# EAGLE design rfm98pw-wing (EAGLE 9.4.2)
PROJECT_AUTHOR: Tinkerman <xose.perez@gmail.com>; PROJECT_LICENSE: CC-BY-SA 4.0 Intl.; PROJECT_NAME: RFM98PW Feather Wing; PROJECT_VERSION: 0.1.20190707
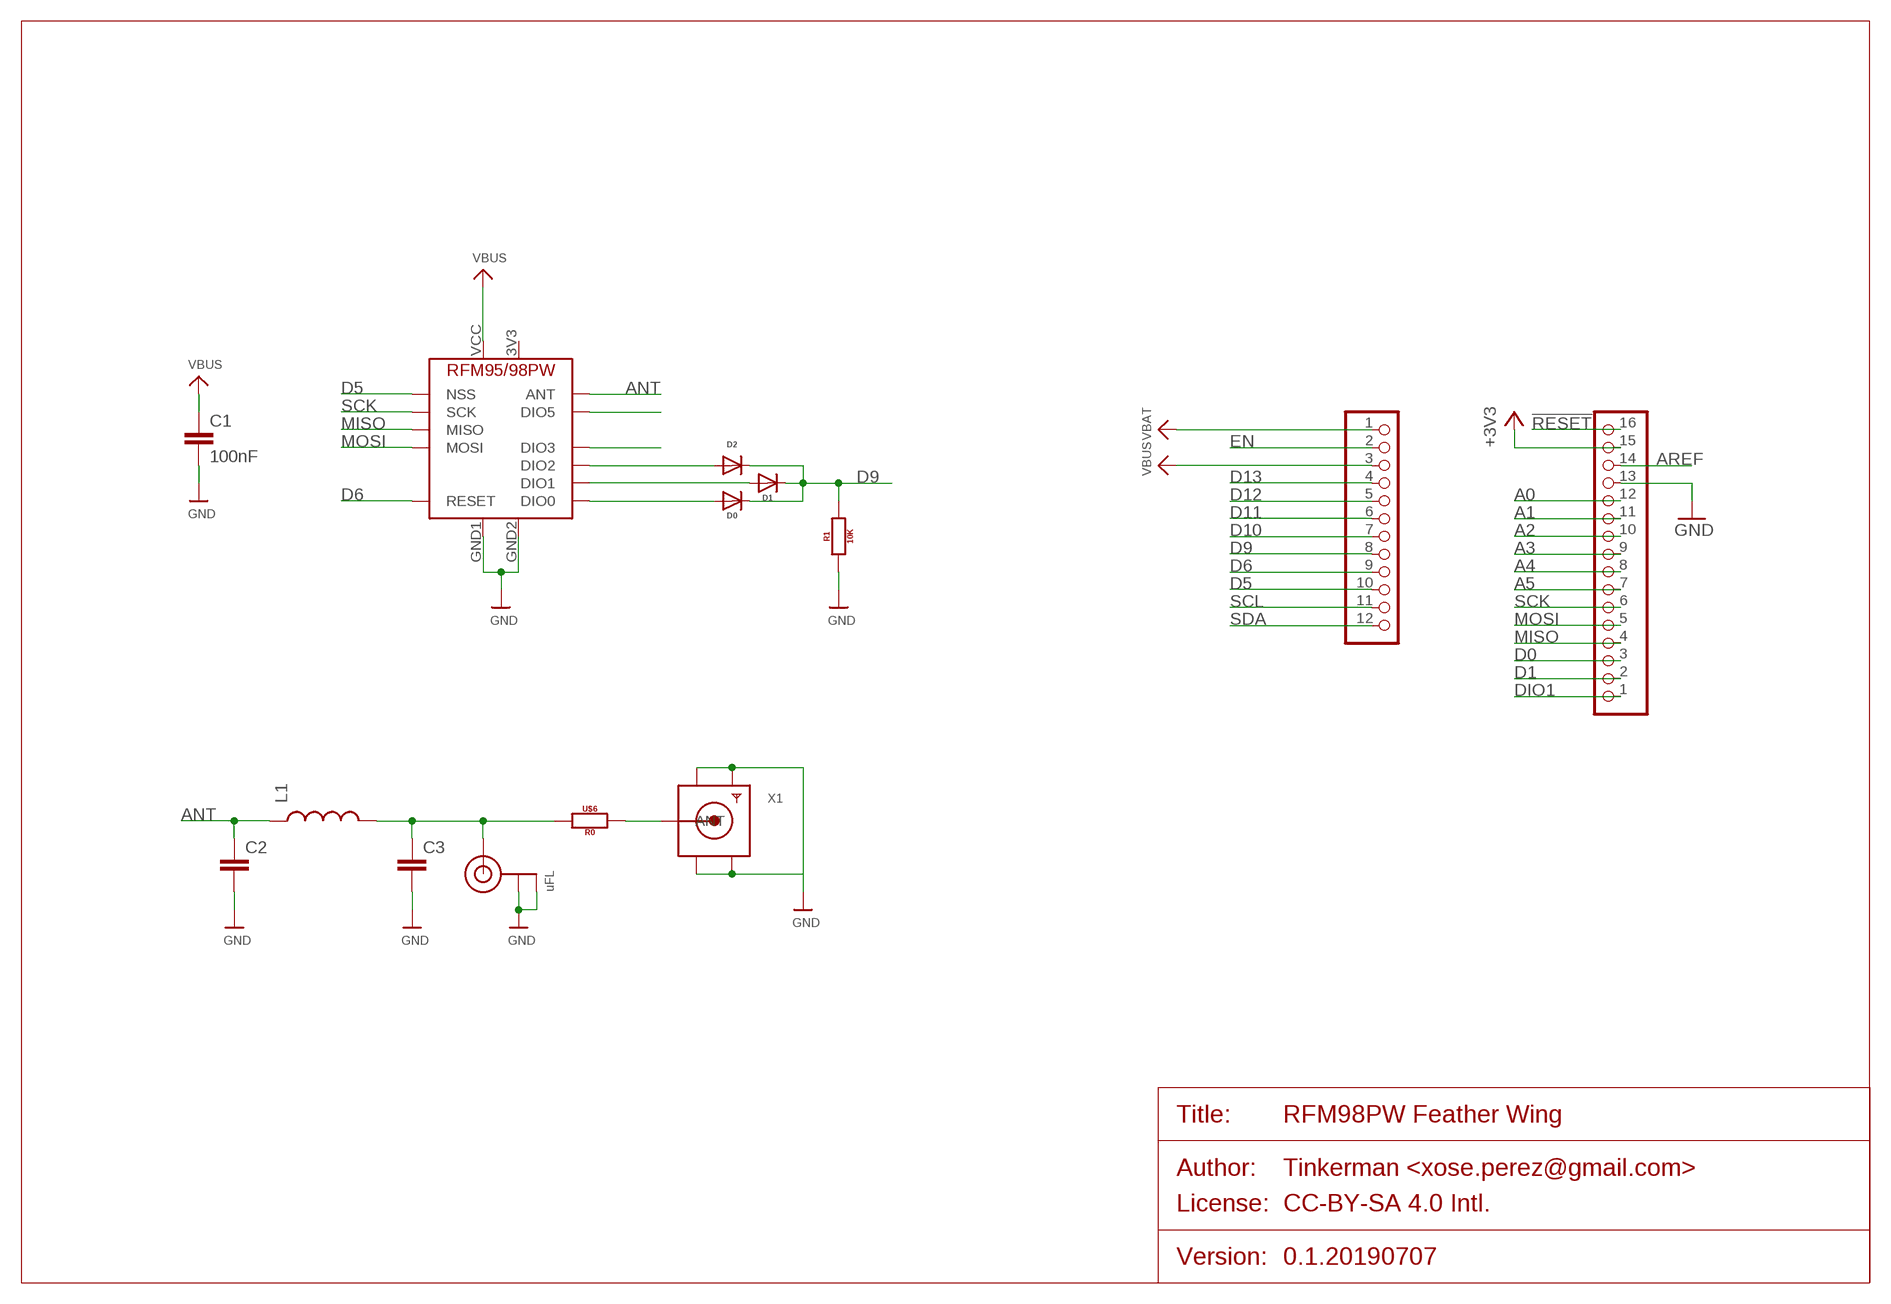
[diagram p0: schematic, sheet 1]

## Parts
C1  100nF  C-EUC0805K  [C0805K]
C2  C-EUC0805K  [C0805K]
C3  C-EUC0805K  [C0805K]
D0  DIODE-SMD  [0805_DIODE]
D1  DIODE-SMD  [0805_DIODE]
D2  DIODE-SMD  [0805_DIODE]
JP1  HEADER-1X16ROUND  [1X16_ROUND]
JP3  HEADER-1X12  [1X12_ROUND]
L1  INDUCTOR-SPARKFUN0805  [0805]
R1  10K  RESISTOR0805  [0805]
U$6  R0  RESISTOR0805  [0805]
U$24  RFM95PW-RFM98PW  [RFM95PW-RFM98PW]
X1  SMACONNECTOR_EDGE  [SMA_EDGELAUNCH]
X4  uFL  ANTENNA_U.FL  [U.FL]

## Nets
!RESET: JP1.16
+3V3: JP1.15
A0: JP1.12
A1: JP1.11
A2: JP1.10
A3: JP1.9
A4: JP1.8
A5: JP1.7
ANT: C2.1 L1.1 U$24.ANT
ANT1: U$6.2 X1.P(ANT)
AREF: JP1.14
D0: JP1.3
D1: JP1.2
D5: JP3.10 U$24.NSS
D6: JP3.9 U$24.RESET
D9: D0.C D1.C D2.C JP3.8 R1.2
D10: JP3.7
D11: JP3.6
D12: JP3.5
D13: JP3.4
DIO1: JP1.1
EN: JP3.2
GND: C1.2 C2.2 C3.2 JP1.13 R1.1 U$24.GND1 U$24.GND2 X1.GND@1(GND4) X1.GND@2(GND3) X1.GND@3(GND2) X1.GND@4(GND1) X4.1(GND) X4.2(GND)
MISO: JP1.4 U$24.MISO
MOSI: JP1.5 U$24.MOSI
N$3: D0.A U$24.DIO0
N$4: D1.A U$24.DIO1
N$5: D2.A U$24.DIO2
N$6: U$24.DIO3
N$8: U$24.DIO5
N$9: C3.1 L1.2 U$6.1 X4.3(SIGNAL)
SCK: JP1.6 U$24.SCK
SCL: JP3.11
SDA: JP3.12
VBAT: JP3.1
VBUS: C1.1 JP3.3 U$24.VCC

## Power pins joined to a net without a drawn wire
3V3: U$24.3V3

## Library data of the parts
C1-C3 = xose:C-EU: CAPACITOR, European symbol
D0 D1 D2 = xose:DIODE
JP1 = microbuilder:HEADER-1X16: PIN HEADER
JP3 = microbuilder:HEADER-1X12
L1 = Spark:INDUCTOR-SPARKFUN: Inductors Basic Inductor/Choke - 0603 and 1206. Footprints are not proven and vary greatly between part numbers. SRN6045- 33uH, 20% 1.4A
R1 U$6 = xose:RESISTOR: Generic EU resistor symbol
U$24 = xose:RFM95PW-RFM98PW
X1 = adafruit:SMACONNECTOR: SMA Connector 90° DIP SMA Connector, 50 Ohm (4UConnector: 07259)
X4 = adafruit:ANTENNA_U.FL: U.FL Antenna Connector

## Board
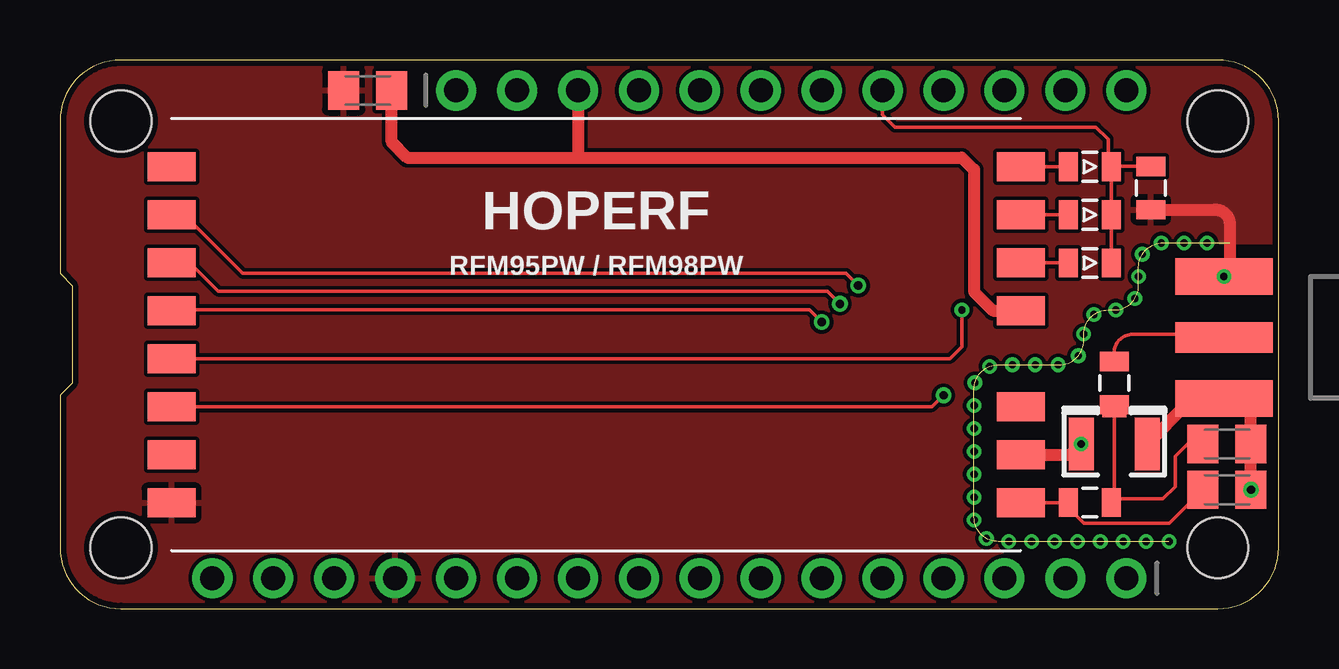
[diagram p1: board, top side]
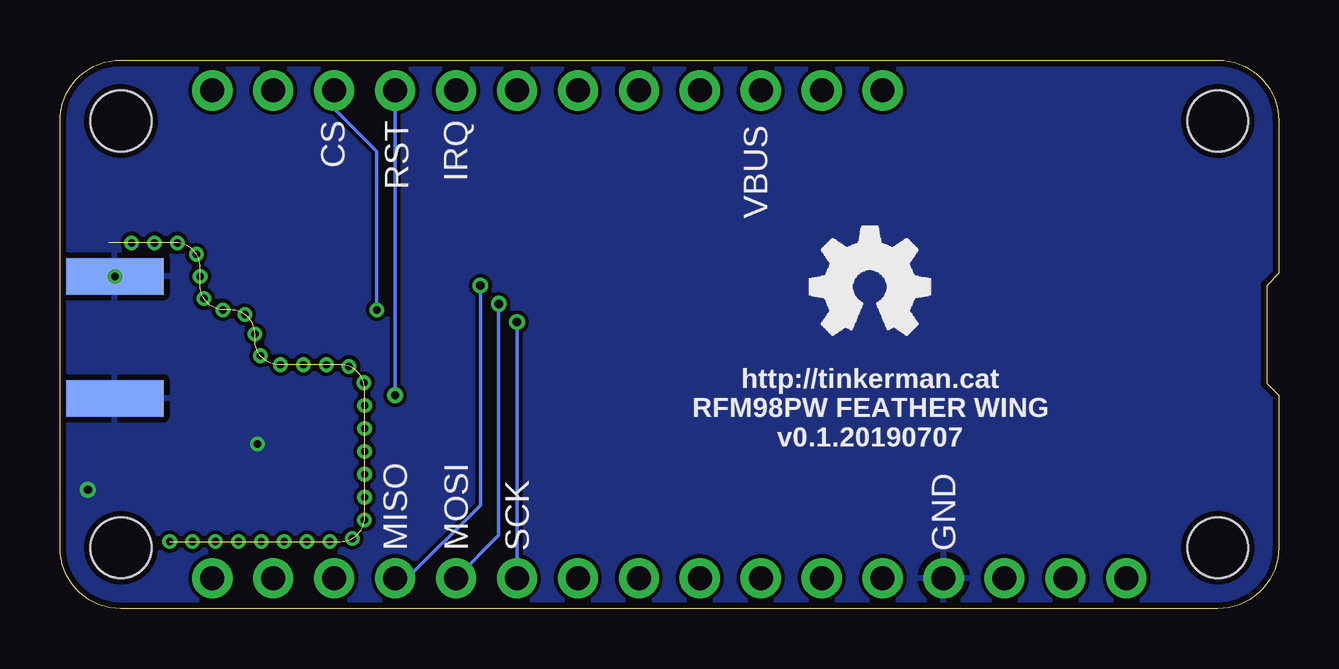
[diagram p2: board, bottom side, seen from below]

Size 50.8 x 22.86 mm. Coordinates in mm from the lower left corner, seen from the top.
Outline: 2.54,0 48.26,0 arc90 50.8,2.54 50.8,20.32 arc90 48.26,22.86 2.54,22.86 arc90 0,20.32 0,13.97 0.51,13.46 0.51,9.4 0,8.89 0,2.54 arc90 2.54,0
Copper layers (1*16): Top 0.035mm / dielectric 1.5mm / Bottom 0.035mm
Design rules "seedstudio-2layer": minimum track width 6mil, minimum drill 12mil, track to track 6mil, track to pad 6mil, pad to pad 6mil, via to via 6mil, smd to smd 0mil, copper to edge 10mil, drill to drill 10mil, minimum pad ring 10mil, minimum via ring 6mil, stop-mask expansion 2mil, vias tented up to drill 100mil, thermal gap 10mil
Holes 2.54 mm at 48.26,20.32 48.26,2.54 2.54,20.32 2.54,2.54
Milling: 13 lines

### Footprints (pad centres in the part's own frame; a part is rotated, then mirrored left to right if it is on the bottom)
C0805K = smd 1.3 x 1.6: 1 -1,0; 2 1,0
0805_DIODE = smd 0.8 x 1.2: A -0.9,0; C 0.9,0
1X16_ROUND = drill 1 pad 1.676: 1 -19.05,0; 2 -16.51,0; 3 -13.97,0; 4 -11.43,0; 5 -8.89,0; 6 -6.35,0; 7 -3.81,0; 8 -1.27,0; 9 1.27,0; 10 3.81,0; 11 6.35,0; 12 8.89,0; 13 11.43,0; 14 13.97,0; 15 16.51,0; 16 19.05,0
1X12_ROUND = drill 1 pad 1.676: 1 -13.97,0; 2 -11.43,0; 3 -8.89,0; 4 -6.35,0; 5 -3.81,0; 6 -1.27,0; 7 1.27,0; 8 3.81,0; 9 6.35,0; 10 8.89,0; 11 11.43,0; 12 13.97,0
0805 = smd 0.8 x 1.2: 1 -0.9,0; 2 0.9,0
RFM95PW-RFM98PW = smd 2 x 1.2: 3V3 0,16; ANT 35.4,2; DIO0 35.4,12; DIO1 35.4,14; DIO2 35.4,16; DIO3 35.4,6; DIO5 0,4; GND1 35.4,4; GND2 0,2; MISO 0,14; MOSI 0,12; NSS 0,8; RESET 0,6; SCK 0,10; VCC 35.4,10
SMA_EDGELAUNCH = smd 4.064 x 1.524: GND@1 2.032,-2.54; GND@2 2.032,2.54 | smd 4.064 x 1.524 bottom: GND@3 2.032,2.54; GND@4 2.032,-2.54 | smd 4.064 x 1.27: P 2.032,0
U.FL = smd 2.2 x 1.05: 1 0,1.375; 2 0,-1.375 | smd 0.8 x 1: 3 1.525,0

### Placement (x,y rotation side)
C1  12.83,21.59 180 top
C2  48.64,4.95 0 top
C3  48.64,6.86 0 top
D0  42.93,14.4 0 top
D1  42.93,16.41 0 top
D2  42.93,18.41 0 top
JP1  25.4,1.27 180 top
JP3  30.48,21.59 0 top
L1  42.93,4.42 0 top
R1  45.47,17.53 90 top
U$6  43.94,9.4 90 top
U$24  4.65,2.41 0 top
X1  50.55,11.3 180 top
X4  43.94,6.86 90 top

### Tracks (layer width: path | path; a pad name or v marks a point on that pad's centre or on a via)
ANT
  Top 0.152: U$24.ANT 42.02,4.41 L1.1 42.03,4.2 42.67,3.56 46.24,3.56 C2.1
ANT1
  Top 0.152: X1.P arc90 48.39,11.43 44.7,11.43 arc90 43.94,10.67 U$6.2
D5  (via drill 0.3)
  Top 0.152: v37.59,12.45 37.59,10.92 37.08,10.41 U$24.NSS
  Bottom 0.152: JP3.10 39.37,20.83 37.59,19.05 v37.59,12.45
D6  (via drill 0.35)
  Top 0.152: U$24.RESET 36.35,8.41 v36.83,8.89
  Bottom 0.152: JP3.9 v36.83,8.89
D9
  Top 0.152: D0.C D1.C D2.C | D2.C 43.69,18.55 43.69,19.56 43.18,20.07 34.8,20.07 34.29,20.57 JP3.8 | D2.C arc-90 43.84,18.43 R1.2
GND  (via drill 0.3, 0.35)
  Top 0.508: C2.2 C3.2 49.64,8.27 49.15,8.76 X1.GND@3 47.12,8.76 46.99,8.64 46.99,8.53 X4.2 | U$24.GND1 42.12,6.41 X4.1 | R1.1 48.14,16.63 arc-90 48.77,16 48.77,14.1 X1.GND@1
  other vias: 49.64,4.95 48.51,13.84 42.57,6.86
  pour Bottom: 50.8,0 0,0 0,22.86 50.8,22.86
  pour Top: 0,0 0,22.86 50.8,22.86 50.8,15.24 46.23,15.24 arc90 44.96,13.97 44.96,13.72 arc-90 43.69,12.45 43.43,12.45 arc90 42.67,11.68 42.67,11.18 arc-90 41.66,10.16 41.15,10.16 39.37,10.16 arc90 38.1,8.89 38.1,8.64 38.1,3.81 arc90 39.12,2.79 39.62,2.79 50.8,2.79 50.8,0
MISO  (via drill 0.35)
  Top 0.152: U$24.MISO 5.18,16.41 7.62,13.97 32.77,13.97 v33.27,13.46
  Bottom 0.152: v33.27,13.46 33.27,4.32 36.32,1.27 JP1.4
MOSI  (via drill 0.35)
  Top 0.152: v32.51,12.7 31.99,13.23 6.59,13.23 5.33,14.48 4.71,14.48 U$24.MOSI
  Bottom 0.152: JP1.5 32.51,3.05 v32.51,12.7
N$1  (via drill 0.3)
  other vias: 46.23,2.79
N$2  (via drill 0.3)
  other vias: 45.27,2.79
N$3
  Top 0.152: U$24.DIO0 42.02,14.41 D0.A
N$4
  Top 0.152: U$24.DIO1 D1.A
N$5
  Top 0.152: U$24.DIO2 D2.A
N$7  (via drill 0.3)
  other vias: 44.32,2.79
N$9
  Top 0.152: C3.1 46.99,6.86 46.48,6.35 46.48,5.08 45.97,4.57 43.98,4.57 L1.2 arc90 43.94,4.54 U$6.1 X4.3
N$10  (via drill 0.3)
  other vias: 43.37,2.79
N$11  (via drill 0.3)
  other vias: 42.41,2.79
N$12  (via drill 0.3)
  other vias: 41.46,2.79
N$13  (via drill 0.3)
  other vias: 40.5,2.79
N$14  (via drill 0.3)
  other vias: 39.55,2.79
N$15  (via drill 0.3)
  other vias: 38.62,2.92
N$16  (via drill 0.3)
  other vias: 38.11,3.69
N$17  (via drill 0.3)
  other vias: 38.1,4.64
N$18  (via drill 0.3)
  other vias: 38.1,5.6
N$19  (via drill 0.3)
  other vias: 38.1,6.55
N$20  (via drill 0.3)
  other vias: 38.1,7.51
N$21  (via drill 0.3)
  other vias: 38.1,8.46
N$22  (via drill 0.3)
  other vias: 38.14,9.41
N$23  (via drill 0.3)
  other vias: 38.75,10.09
N$24  (via drill 0.3)
  other vias: 39.7,10.16
N$25  (via drill 0.3)
  other vias: 40.65,10.16
N$26  (via drill 0.3)
  other vias: 41.61,10.16
N$27  (via drill 0.3)
  other vias: 42.45,10.54
N$28  (via drill 0.3)
  other vias: 42.67,11.44
N$29  (via drill 0.3)
  other vias: 43.1,12.26
N$30  (via drill 0.3)
  other vias: 44.01,12.45
N$31  (via drill 0.3)
  other vias: 44.8,12.92
N$32  (via drill 0.3)
  other vias: 44.96,13.84
N$33  (via drill 0.3)
  other vias: 45.12,14.77
N$34  (via drill 0.3)
  other vias: 45.91,15.24
N$35  (via drill 0.3)
  other vias: 46.86,15.24
N$36  (via drill 0.3)
  other vias: 47.81,15.24
SCK  (via drill 0.35)
  Top 0.152: v31.75,11.94 31.24,12.45 4.68,12.45 U$24.SCK
  Bottom 0.152: v31.75,11.94 JP1.6
VBUS
  Top 0.508: U$24.VCC 38.9,12.41 38.1,13.21 38.1,18.29 37.59,18.8 21.59,18.8 | 21.59,18.8 14.48,18.8 13.83,19.45 C1.1 | JP3.3 21.59,18.8

### Text on the board
bPlace: VBUS | IRQ | RST | CS | GND | SCK | MOSI | MISO
bNames: http://tinkerman.cat / RFM98PW FEATHER WING / v0.1.20190707